# Altium schematic sheet MXM 3.1 Connector Interface.SchDoc
size Tabloid; DrawnBy: Krutav Shah; SheetNumber: 4; SheetTotal: 6
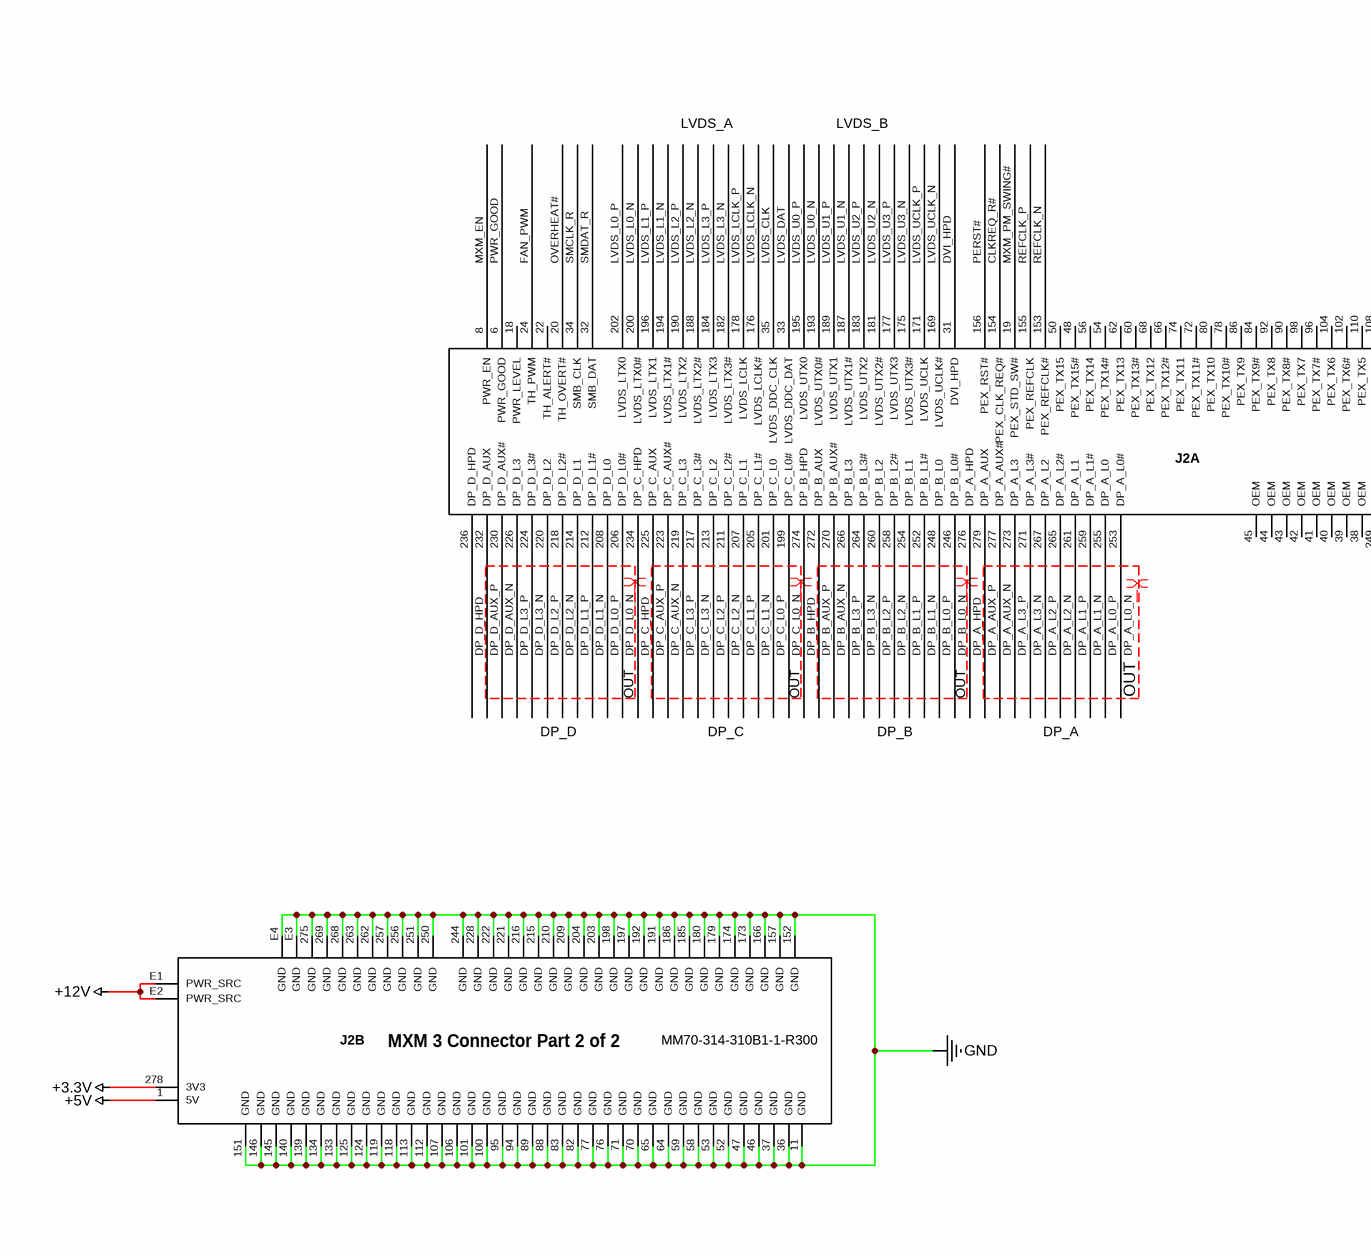
[diagram p0: MXM 3.1 Connector Interface.SchDoc, left]
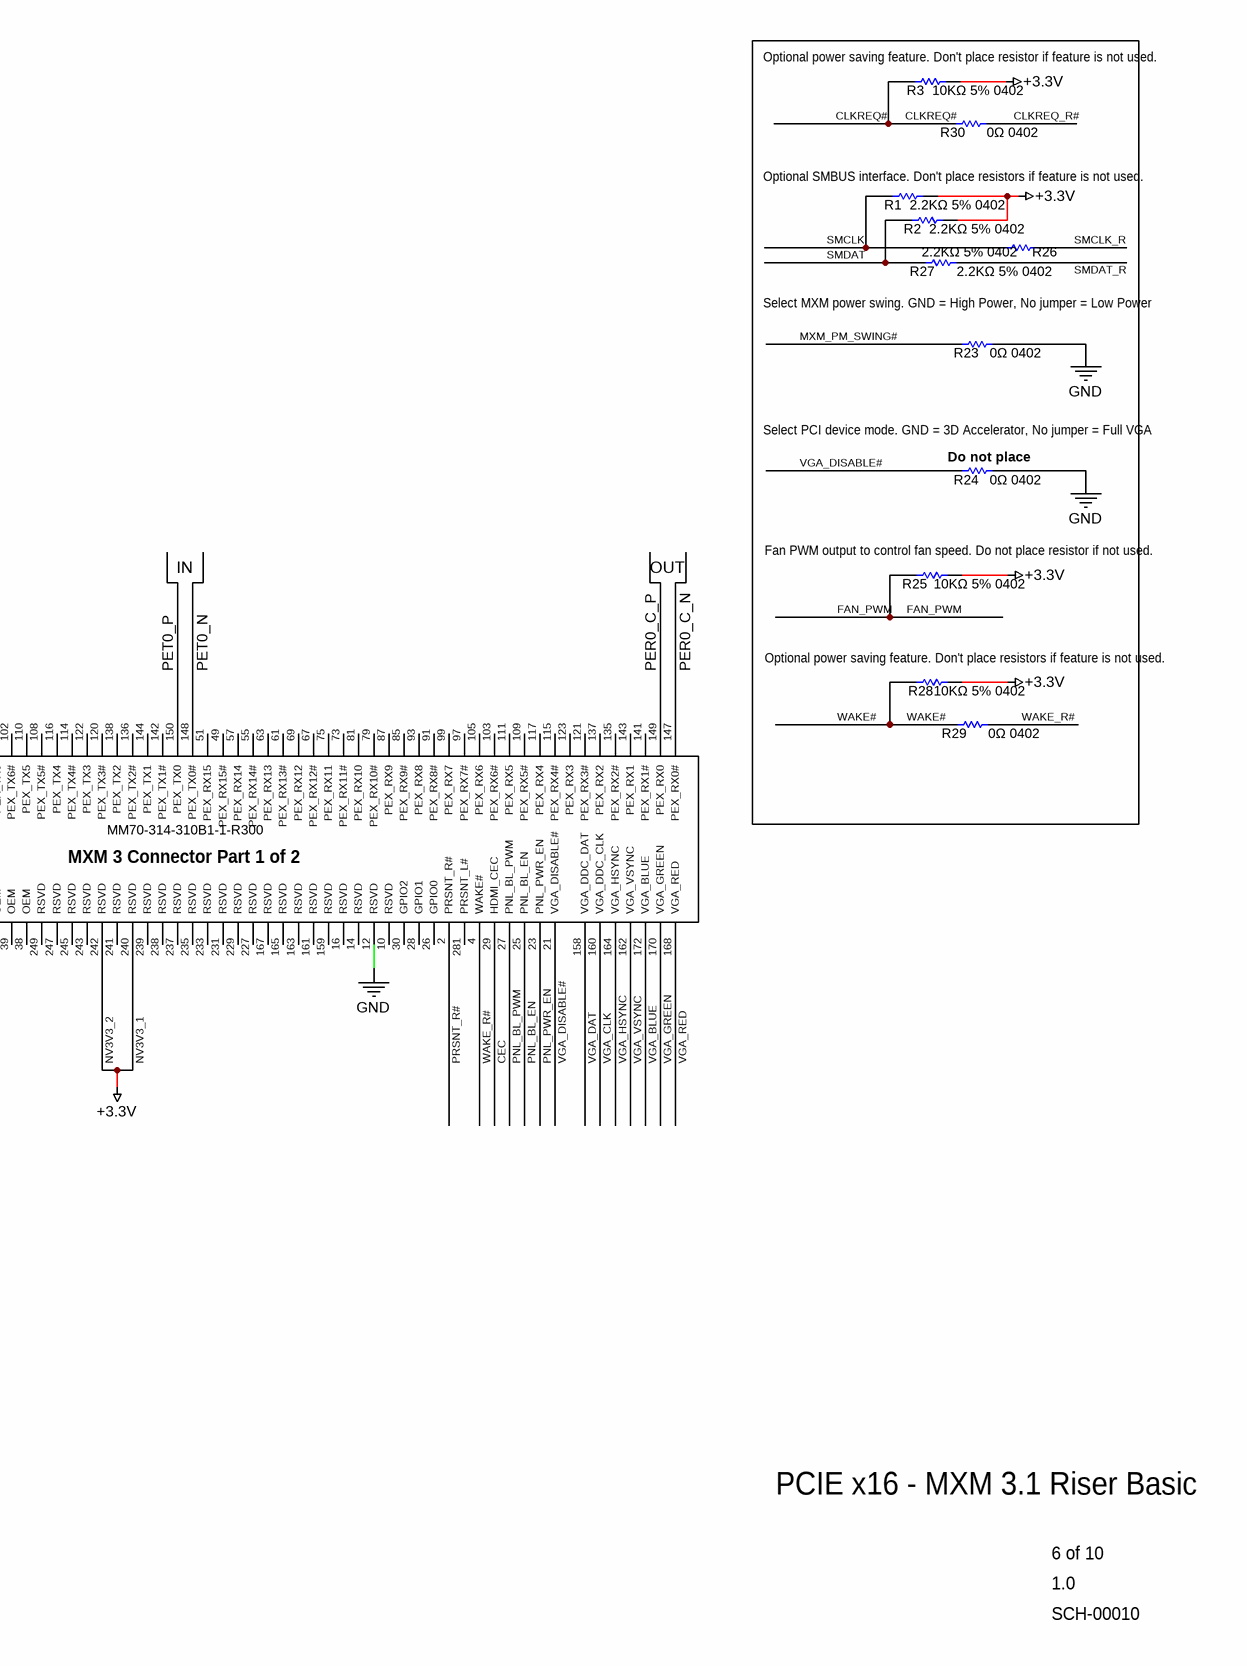
[diagram p1: MXM 3.1 Connector Interface.SchDoc, right]

## Parts
J2  MM70-314-310B1-1-R300  [JAE_MM70-314-310B1-2-R300]  (parts A,B of 2)
R1  2.2KΩ 5% 0402  [RESC0201(0603)_L]
R2  2.2KΩ 5% 0402  [RESC0201(0603)_L]
R3  10KΩ 5% 0402  [RESC0201(0603)_L]
R23  0Ω 0402  [RESC0201(0603)_L]
R24  0Ω 0402  [RESC0201(0603)_L]
R25  10KΩ 5% 0402  [RESC0201(0603)_L]
R26  2.2KΩ 5% 0402  [RESC0201(0603)_L]
R27  2.2KΩ 5% 0402  [RESC0201(0603)_L]
R28  10KΩ 5% 0402  [RESC0201(0603)_L]
R29  0Ω 0402  [RESC0201(0603)_L]
R30  0Ω 0402  [RESC0201(0603)_L]

## Blocks framed on the sheet
Do not place: R1-R3 R23-R30

## Nets
+5V: J2.1(5V)
+12V: J2.E1(PWR_SRC) J2.E2(PWR_SRC)
GND: J2.11(GND) J2.12(RSVD) J2.36(GND) J2.37(GND) J2.46(GND) J2.47(GND) J2.52(GND) J2.53(GND) J2.58(GND) J2.59(GND) J2.64(GND) J2.65(GND) J2.70(GND) J2.71(GND) J2.76(GND) J2.77(GND) J2.82(GND) J2.83(GND) J2.88(GND) J2.89(GND) J2.94(GND) J2.95(GND) J2.100(GND) J2.101(GND) J2.106(GND) J2.107(GND) J2.112(GND) J2.113(GND) J2.118(GND) J2.119(GND) J2.124(GND) J2.125(GND) J2.133(GND) J2.134(GND) J2.139(GND) J2.140(GND) J2.145(GND) J2.146(GND) J2.151(GND) J2.152(GND) J2.157(GND) J2.166(GND) J2.173(GND) J2.174(GND) J2.179(GND) J2.180(GND) J2.185(GND) J2.186(GND) J2.191(GND) J2.192(GND) J2.197(GND) J2.198(GND) J2.203(GND) J2.204(GND) J2.209(GND) J2.210(GND) J2.215(GND) J2.216(GND) J2.221(GND) J2.222(GND) J2.228(GND) J2.244(GND) J2.250(GND) J2.251(GND) J2.256(GND) J2.257(GND) J2.262(GND) J2.263(GND) J2.268(GND) J2.269(GND) J2.275(GND) J2.E3(GND) J2.E4(GND) R23.1 R24.1
NV3V3_1: J2.240(RSVD) J2.242(RSVD) J2.278(3V3) R1.1 R2.1 R3.1 R25.1 R28.1  [also labelled +3.3V, NV3V3_2]
CEC: J2.29(HDMI_CEC)
CLKREQ#: R3.2 R30.2
CLKREQ_R#: J2.154(PEX_CLK_REQ#) R30.1
DP_A_AUX_N: J2.277(DP_A_AUX#)
DP_A_AUX_P: J2.279(DP_A_AUX)
DP_A_HPD: J2.276(DP_A_HPD)
DP_A_L0_N: J2.253(DP_A_L0#)
DP_A_L0_P: J2.255(DP_A_L0)
DP_A_L1_N: J2.259(DP_A_L1#)
DP_A_L1_P: J2.261(DP_A_L1)
DP_A_L2_N: J2.265(DP_A_L2#)
DP_A_L2_P: J2.267(DP_A_L2)
DP_A_L3_N: J2.271(DP_A_L3#)
DP_A_L3_P: J2.273(DP_A_L3)
DP_B_AUX_N: J2.270(DP_B_AUX#)
DP_B_AUX_P: J2.272(DP_B_AUX)
DP_B_HPD: J2.274(DP_B_HPD)
DP_B_L0_N: J2.246(DP_B_L0#)
DP_B_L0_P: J2.248(DP_B_L0)
DP_B_L1_N: J2.252(DP_B_L1#)
DP_B_L1_P: J2.254(DP_B_L1)
DP_B_L2_N: J2.258(DP_B_L2#)
DP_B_L2_P: J2.260(DP_B_L2)
DP_B_L3_N: J2.264(DP_B_L3#)
DP_B_L3_P: J2.266(DP_B_L3)
DP_C_AUX_N: J2.223(DP_C_AUX#)
DP_C_AUX_P: J2.225(DP_C_AUX)
DP_C_HPD: J2.234(DP_C_HPD)
DP_C_L0_N: J2.199(DP_C_L0#)
DP_C_L0_P: J2.201(DP_C_L0)
DP_C_L1_N: J2.205(DP_C_L1#)
DP_C_L1_P: J2.207(DP_C_L1)
DP_C_L2_N: J2.211(DP_C_L2#)
DP_C_L2_P: J2.213(DP_C_L2)
DP_C_L3_N: J2.217(DP_C_L3#)
DP_C_L3_P: J2.219(DP_C_L3)
DP_D_AUX_N: J2.230(DP_D_AUX#)
DP_D_AUX_P: J2.232(DP_D_AUX)
DP_D_HPD: J2.236(DP_D_HPD)
DP_D_L0_N: J2.206(DP_D_L0#)
DP_D_L0_P: J2.208(DP_D_L0)
DP_D_L1_N: J2.212(DP_D_L1#)
DP_D_L1_P: J2.214(DP_D_L1)
DP_D_L2_N: J2.218(DP_D_L2#)
DP_D_L2_P: J2.220(DP_D_L2)
DP_D_L3_N: J2.224(DP_D_L3#)
DP_D_L3_P: J2.226(DP_D_L3)
DVI_HPD: J2.31(DVI_HPD)
FAN_PWM: J2.24(TH_PWM) R25.2
LVDS_CLK: J2.35(LVDS_DDC_CLK)
LVDS_DAT: J2.33(LVDS_DDC_DAT)
LVDS_L0_N: J2.200(LVDS_LTX0#)
LVDS_L0_P: J2.202(LVDS_LTX0)
LVDS_L1_N: J2.194(LVDS_LTX1#)
LVDS_L1_P: J2.196(LVDS_LTX1)
LVDS_L2_N: J2.188(LVDS_LTX2#)
LVDS_L2_P: J2.190(LVDS_LTX2)
LVDS_L3_N: J2.182(LVDS_LTX3#)
LVDS_L3_P: J2.184(LVDS_LTX3)
LVDS_LCLK_N: J2.176(LVDS_LCLK#)
LVDS_LCLK_P: J2.178(LVDS_LCLK)
LVDS_U0_N: J2.193(LVDS_UTX0#)
LVDS_U0_P: J2.195(LVDS_UTX0)
LVDS_U1_N: J2.187(LVDS_UTX1#)
LVDS_U1_P: J2.189(LVDS_UTX1)
LVDS_U2_N: J2.181(LVDS_UTX2#)
LVDS_U2_P: J2.183(LVDS_UTX2)
LVDS_U3_N: J2.175(LVDS_UTX3#)
LVDS_U3_P: J2.177(LVDS_UTX3)
LVDS_UCLK_N: J2.169(LVDS_UCLK#)
LVDS_UCLK_P: J2.171(LVDS_UCLK)
MXM_EN: J2.8(PWR_EN)
MXM_PM_SWING#: J2.19(PEX_STD_SW#) R23.2
OVERHEAT#: J2.20(TH_OVERT#)
PER0_C_N: J2.147(PEX_RX0#)
PER0_C_P: J2.149(PEX_RX0)
PERST#: J2.156(PEX_RST#)
PET0_N: J2.148(PEX_TX0#)
PET0_P: J2.150(PEX_TX0)
PNL_BL_EN: J2.25(PNL_BL_EN)
PNL_BL_PWM: J2.27(PNL_BL_PWM)
PNL_PWR_EN: J2.23(PNL_PWR_EN)
PRSNT_R#: J2.2(PRSNT_R#)
PWR_GOOD: J2.6(PWR_GOOD)
REFCLK_N: J2.153(PEX_REFCLK#)
REFCLK_P: J2.155(PEX_REFCLK)
SMCLK: R1.2 R26.2
SMCLK_R: J2.34(SMB_CLK) R26.1
SMDAT: R2.2 R27.2
SMDAT_R: J2.32(SMB_DAT) R27.1
VGA_BLUE: J2.172(VGA_BLUE)
VGA_CLK: J2.160(VGA_DDC_CLK)
VGA_DAT: J2.158(VGA_DDC_DAT)
VGA_DISABLE#: J2.21(VGA_DISABLE#) R24.2
VGA_GREEN: J2.170(VGA_GREEN)
VGA_HSYNC: J2.164(VGA_HSYNC)
VGA_RED: J2.168(VGA_RED)
VGA_VSYNC: J2.162(VGA_VSYNC)
WAKE#: R28.2 R29.2
WAKE_R#: J2.4(WAKE#) R29.1

Not connected (* = marked no-connect by the designer): J2 10(RSVD) 14(RSVD) 16(RSVD) 18(PWR_LEVEL) 22(TH_ALERT#) 26(GPIO0) 28(GPIO1) 30(GPIO2) 38(OEM) 39(OEM) 40(OEM) 41(OEM) 42(OEM) 43(OEM) 44(OEM) 45(OEM) 48(PEX_TX15#) 49(PEX_RX15#) 50(PEX_TX15) 51(PEX_RX15) 54(PEX_TX14#) 55(PEX_RX14#) 56(PEX_TX14) 57(PEX_RX14) 60(PEX_TX13#) 61(PEX_RX13#) 62(PEX_TX13) 63(PEX_RX13) 66(PEX_TX12#) 67(PEX_RX12#) 68(PEX_TX12) 69(PEX_RX12) 72(PEX_TX11#) 73(PEX_RX11#) 74(PEX_TX11) 75(PEX_RX11) 78(PEX_TX10#) 79(PEX_RX10#) 80(PEX_TX10) 81(PEX_RX10) 84(PEX_TX9#) 85(PEX_RX9#) 86(PEX_TX9) 87(PEX_RX9) 90(PEX_TX8#) 91(PEX_RX8#) 92(PEX_TX8) 93(PEX_RX8) 96(PEX_TX7#) 97(PEX_RX7#) 98(PEX_TX7) 99(PEX_RX7) 102(PEX_TX6#) 103(PEX_RX6#) 104(PEX_TX6) 105(PEX_RX6) 108(PEX_TX5#) 109(PEX_RX5#) 110(PEX_TX5) 111(PEX_RX5) 114(PEX_TX4#) 115(PEX_RX4#) 116(PEX_TX4) 117(PEX_RX4) 120(PEX_TX3#) 121(PEX_RX3#) 122(PEX_TX3) 123(PEX_RX3) 135(PEX_RX2#) 136(PEX_TX2#) 137(PEX_RX2) 138(PEX_TX2) 141(PEX_RX1#) 142(PEX_TX1#) 143(PEX_RX1) 144(PEX_TX1) 159(RSVD) 161(RSVD) 163(RSVD) 165(RSVD) 167(RSVD) 227(RSVD) 229(RSVD) 231(RSVD) 233(RSVD) 235(RSVD) 237(RSVD) 238(RSVD) 239(RSVD) 241(RSVD) 243(RSVD) 245(RSVD) 247(RSVD) 249(RSVD) 281(PRSNT_L#)

## Layout directives
differential pair: DP_A_AUX_N, DP_A_AUX_P, DP_A_L0_N, DP_A_L0_P, DP_A_L1_N, DP_A_L1_P, DP_A_L2_N, DP_A_L2_P, DP_A_L3_N, DP_A_L3_P, DP_B_AUX_N, DP_B_AUX_P, DP_B_L0_N, DP_B_L0_P, DP_B_L1_N, DP_B_L1_P, DP_B_L2_N, DP_B_L2_P, DP_B_L3_N, DP_B_L3_P, DP_C_AUX_N, DP_C_AUX_P, DP_C_L0_N, DP_C_L0_P, DP_C_L1_N, DP_C_L1_P, DP_C_L2_N, DP_C_L2_P, DP_C_L3_N, DP_C_L3_P, DP_D_AUX_N, DP_D_AUX_P, DP_D_L0_N, DP_D_L0_P, DP_D_L1_N, DP_D_L1_P, DP_D_L2_N, DP_D_L2_P, DP_D_L3_N, DP_D_L3_P, LVDS_L0_N, LVDS_L0_P, LVDS_L1_N, LVDS_L1_P, LVDS_L2_N, LVDS_L2_P, LVDS_L3_N, LVDS_L3_P, LVDS_LCLK_N, LVDS_LCLK_P, LVDS_U0_N, LVDS_U0_P, LVDS_U1_N, LVDS_U1_P, LVDS_U2_N, LVDS_U2_P, LVDS_U3_N, LVDS_U3_P, LVDS_UCLK_N, LVDS_UCLK_P, PER0_C_N, PER0_C_P, PET0_N, PET0_P, REFCLK_N, REFCLK_P

## Notes on the sheet
- (near R3) Optional power saving feature. Don't place resistor if feature is not used.
- (near R1) Optional SMBUS interface. Don't place resistors if feature is not used.
- Select MXM power swing. GND = High Power, No jumper = Low Power
- (near R24) Select PCI device mode. GND = 3D Accelerator, No jumper = Full VGA
- LVDS_A
- LVDS_B
- (near R25) Fan PWM output to control fan speed. Do not place resistor if not used.
- IN
- OUT
- (near R28) Optional power saving feature. Don't place resistors if feature is not used.
- DP_D
- DP_C
- DP_B
- DP_A
- PCIE x16 - MXM 3.1 Riser Basic
- 6 of 10
- 1.0
- SCH-00010
- Last Modified:
- Krutav.com
- The Krutav Shah Company
- US-Tabloid
- SIZE:
- SHEET:
- This document and its contents are the property of The Krutav Shah Company. The posessor of this document agrees to the following:
- Proprietary Property Notice:
- 1. Do not distrubte without authorization.
- 3. Use for the purposes of evaluation only.
- 2. Not to reproduce or copy the contents of.
- 4. The Krutav Shah Company reserves all rights.
- Revision:
- Inventory #:
- (in symbol MM70-314-310B1-1-R300, part A) MXM 3 Connector Part 1 of 2
- (in symbol MM70-314-310B1-1-R300, part B) MXM 3 Connector Part 2 of 2

## Library data of the parts
J2 = MM70-314-310B1-1-R300: 314 Position Female Connector MXM 3.0 Gold 0.020 _0.50mm_ Black; MF: JAE Electronics; Package: None; Digi-Key_Part_Number: 670-2431-1-ND; Digi-Key_Purchase_URL: https://www.digikey.com/product-detail/en/jae-electronics/MM70-314-310B1-1-R300/670-2431-1-ND/2183605?utm_source=snapeda&utm_medium=aggregator&utm_campaign=symbol; Value: *; MP: MM70-314-310B1-1-R300; SnapEDA_Link: https://www.snapeda.com/parts/MM70-314-310B1-1-R300/JAE%20Electronics/view-part/553386/?ref=snap
R1-R3 R23-R30 = CMP-1010-00755-1: 1M 0.05W 1% 0201 (0603 Metric)  SMD; Case-Metric: 0603; Value: 1000000.00 Ohm; Case-EIA: 0201; Technology: SMT; Tolerance: 1 %; Power: 0.05 W